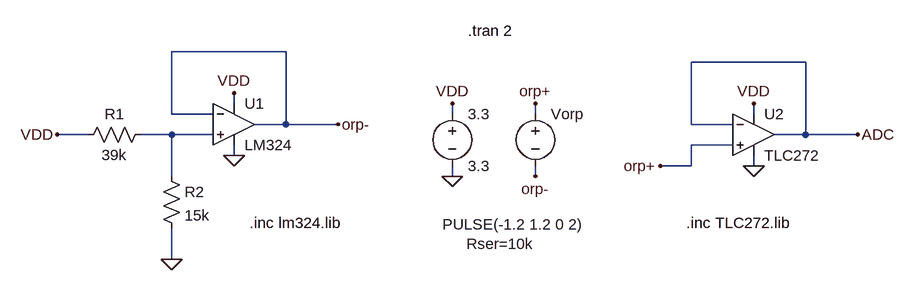
[diagram p0: schematic orp.asc]
orp.asc, the LTspice schematic file:
Version 4
SHEET 1 956 680
WIRE -864 208 -1040 208
WIRE -64 224 -240 224
WIRE -944 288 -944 272
WIRE -1040 304 -1040 208
WIRE -976 304 -1040 304
WIRE -608 304 -608 288
WIRE -480 304 -480 288
WIRE -144 304 -144 288
WIRE -864 320 -864 208
WIRE -864 320 -912 320
WIRE -784 320 -864 320
WIRE -240 320 -240 224
WIRE -176 320 -240 320
WIRE -1168 336 -1216 336
WIRE -1040 336 -1088 336
WIRE -976 336 -1040 336
WIRE -64 336 -64 224
WIRE -64 336 -112 336
WIRE 16 336 -64 336
WIRE -176 352 -240 352
WIRE -944 368 -944 352
WIRE -240 384 -240 352
WIRE -240 384 -288 384
WIRE -144 384 -144 368
WIRE -1040 400 -1040 336
WIRE -608 400 -608 384
WIRE -480 400 -480 384
WIRE -1040 528 -1040 480
FLAG -608 400 0
FLAG -608 288 VDD
FLAG -480 288 orp+
FLAG -944 368 0
FLAG -944 272 VDD
FLAG -1040 528 0
FLAG -784 320 orp-
FLAG -480 400 orp-
FLAG -1216 336 VDD
FLAG -288 384 orp+
FLAG -144 384 0
FLAG -144 288 VDD
FLAG 16 336 ADC
SYMBOL voltage -608 288 R0
WINDOW 123 0 0 Left 0
WINDOW 39 0 0 Left 0
SYMATTR InstName 3.3
SYMATTR Value 3.3
SYMBOL voltage -480 288 R0
WINDOW 123 0 0 Left 0
WINDOW 39 -106 216 Left 2
WINDOW 3 -143 186 Left 2
SYMATTR SpiceLine Rser=10k
SYMATTR Value PULSE(-1.2 1.2 0 2)
SYMATTR InstName Vorp
SYMBOL Opamps\\opamp2 -944 256 R0
SYMATTR InstName U1
SYMATTR Value LM324
SYMBOL res -1072 320 R90
WINDOW 0 0 56 VBottom 2
WINDOW 3 32 56 VTop 2
SYMATTR InstName R1
SYMATTR Value 39k
SYMBOL res -1056 384 R0
SYMATTR InstName R2
SYMATTR Value 15k
SYMBOL Opamps\\opamp2 -144 272 R0
SYMATTR InstName U2
SYMATTR Value TLC272
TEXT -584 176 Left 2 !.tran 2
TEXT -248 472 Left 2 !.inc TLC272.lib
TEXT -920 472 Left 2 !.inc lm324.lib

The netlist it stands for:
* orp.asc
V§3.3 VDD 0 3.3
Vorp orp+ orp- PULSE(-1.2 1.2 0 2) Rser=10k
XU1 N001 orp- VDD 0 orp- LM324  ; pins In+ In- V+ V- OUT
R1 N001 VDD 39k
R2 N001 0 15k
XU2 orp+ ADC VDD 0 ADC TLC272  ; pins In+ In- V+ V- OUT
.tran 2
.inc TLC272.lib
.inc lm324.lib
.backanno
.end